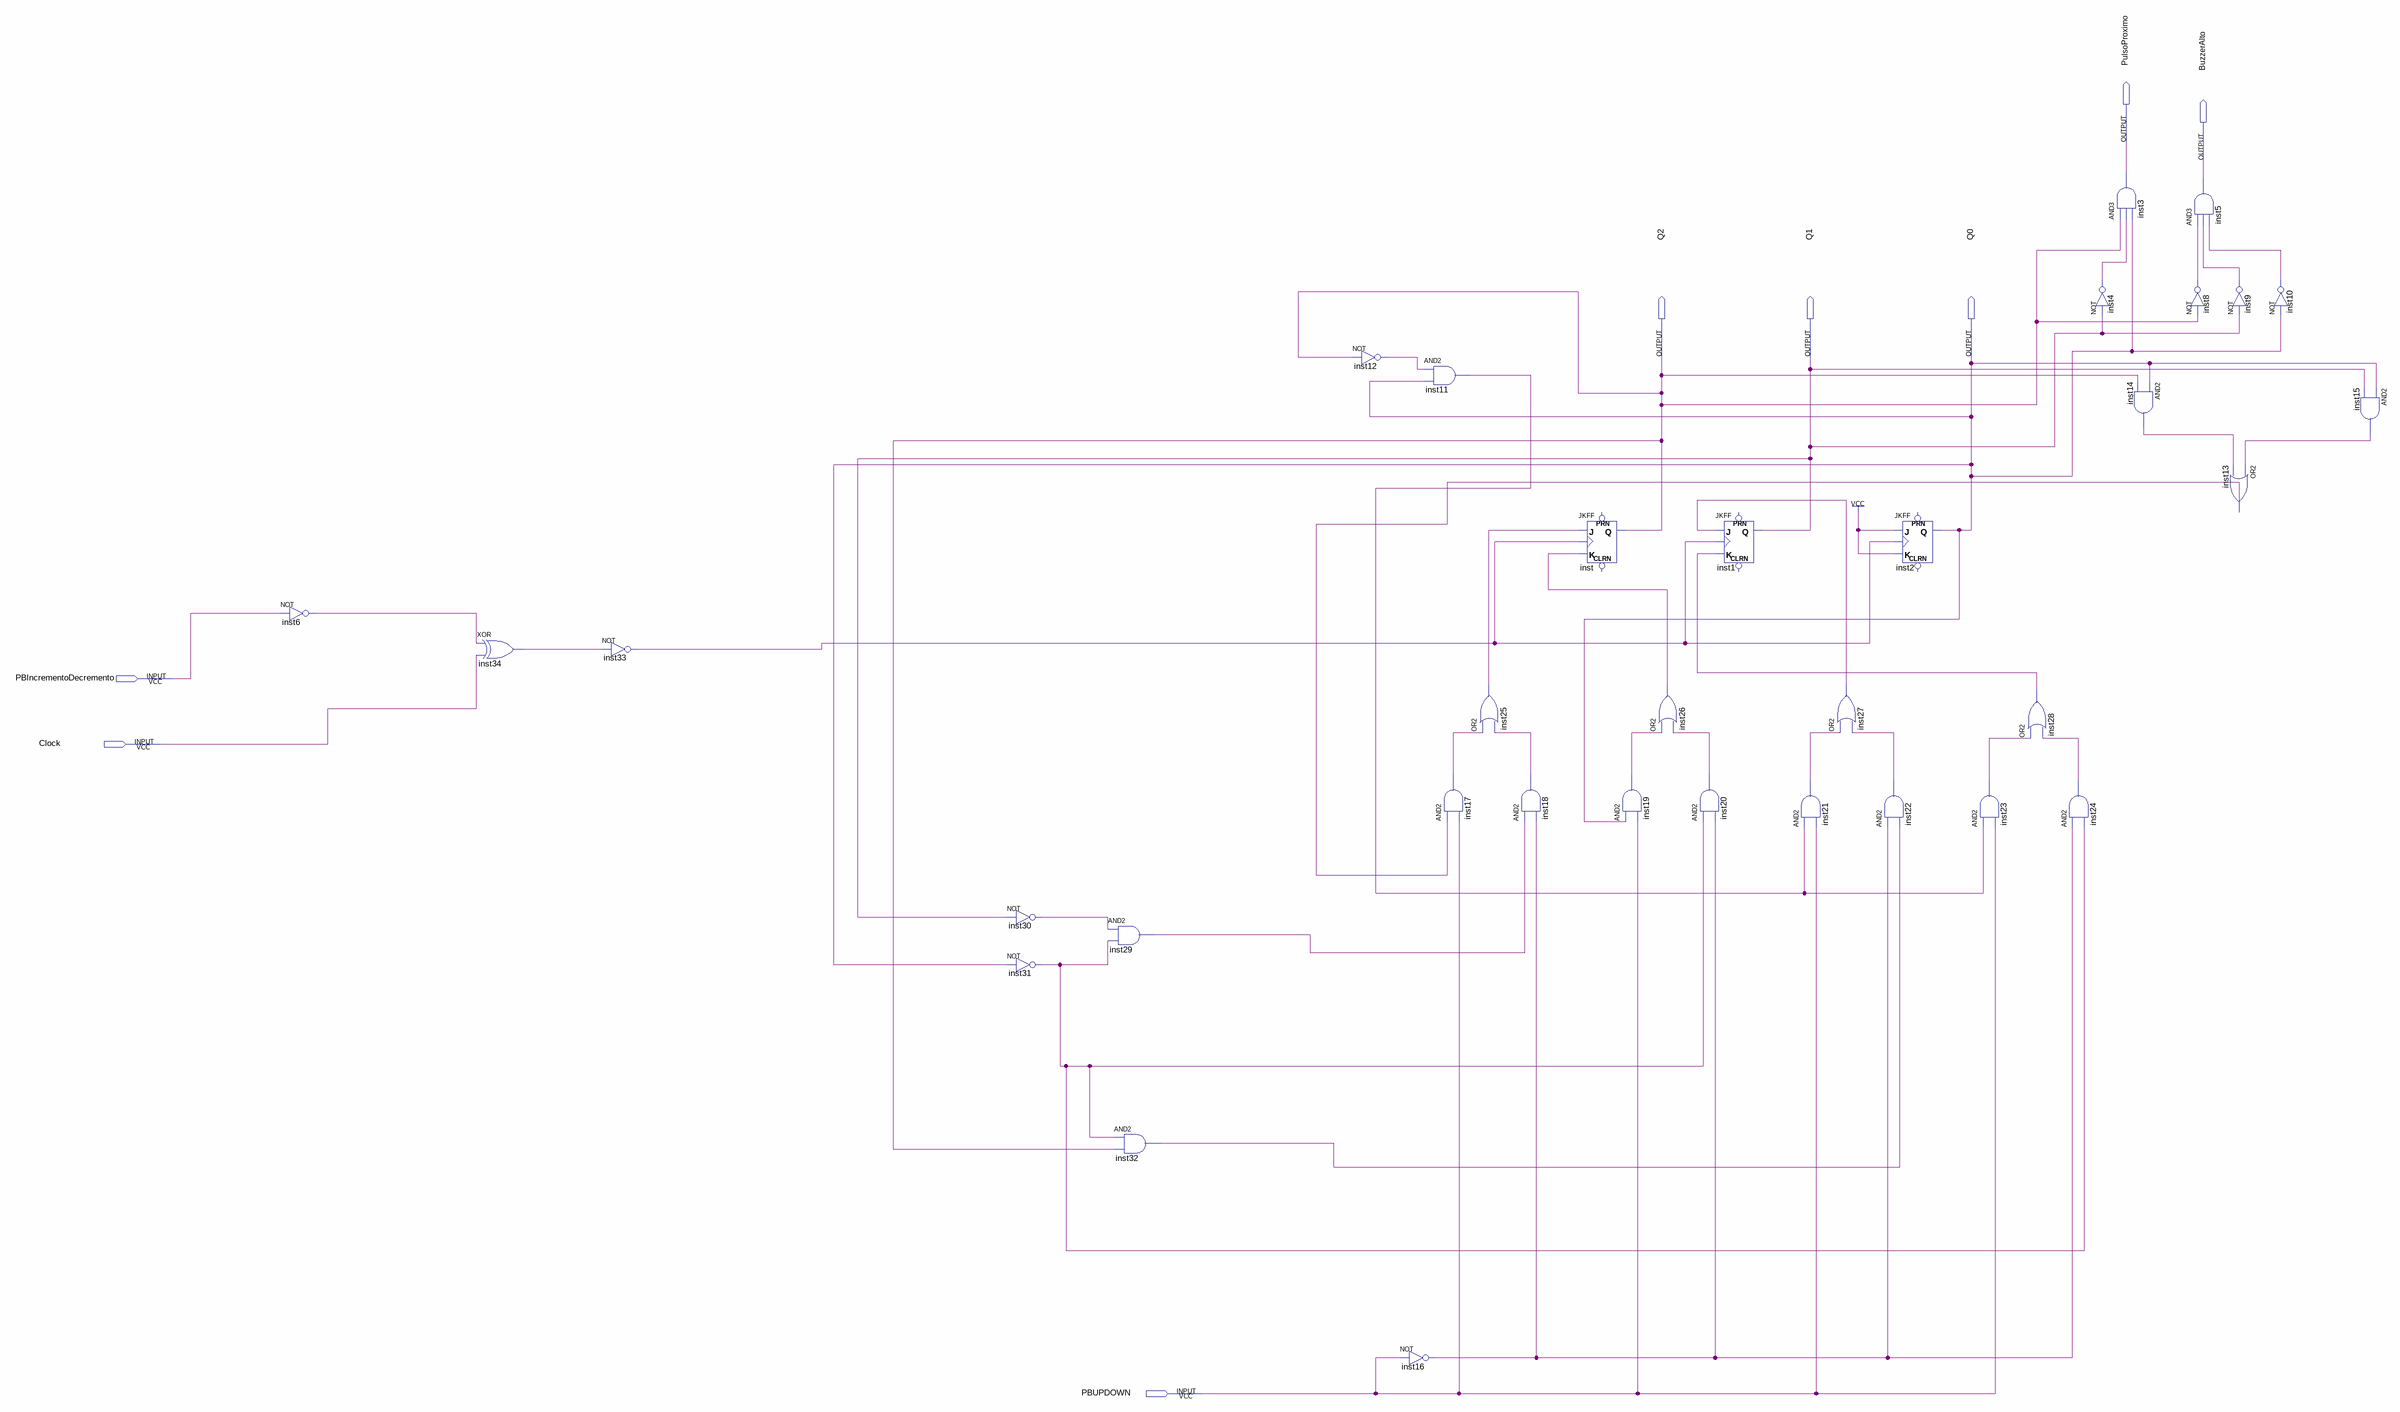
[diagram p0: schematic sheet]
// Quartus schematic contador0a5.bdf as structural Verilog: 34 symbols, 8 pins
module contador0a5 (
  input  PBIncrementoDecremento,
  input  Clock,
  input  PBUPDOWN,
  output PulsoProximo,
  output BuzzerAlto,
  output Q2,
  output Q1,
  output Q0
);

  wire inst4_out, inst6_out, inst8_out, inst9_out, inst10_out, inst11_out, inst12_out, inst13_out,
       inst14_out, inst15_out, inst16_out, inst17_out, inst18_out, inst19_out, inst20_out, inst21_out,
       inst22_out, inst23_out, inst24_out, inst25_out, inst26_out, inst27_out, inst28_out, inst29_out,
       inst30_out, inst31_out, inst32_out, inst33_out, inst34_out;

  not inst6 (inst6_out, PBIncrementoDecremento);
  xor inst34 (inst34_out, inst6_out, Clock);
  not inst33 (inst33_out, inst34_out);
  not inst30 (inst30_out, Q1);
  not inst31 (inst31_out, Q0);
  and inst29 (inst29_out, inst30_out, inst31_out);
  and inst32 (inst32_out, inst31_out, Q2);
  not inst12 (inst12_out, Q2);
  not inst16 (inst16_out, PBUPDOWN);
  and inst11 (inst11_out, inst12_out, Q0);
  and inst17 (inst17_out, inst13_out, PBUPDOWN);
  or inst25 (inst25_out, inst17_out, inst18_out);
  and inst18 (inst18_out, inst29_out, inst16_out);
  JKFF inst (.K(inst26_out), .J(inst25_out), .CLK(inst33_out), .Q(Q2));  // open: PRN, CLRN
  or inst26 (inst26_out, inst19_out, inst20_out);
  and inst19 (inst19_out, Q0, PBUPDOWN);
  and inst20 (inst20_out, inst31_out, inst16_out);
  JKFF inst1 (.K(inst28_out), .J(inst27_out), .CLK(inst33_out), .Q(Q1));  // open: PRN, CLRN
  and inst21 (inst21_out, inst11_out, PBUPDOWN);
  or inst27 (inst27_out, inst21_out, inst22_out);
  and inst22 (inst22_out, inst16_out, inst32_out);
  JKFF inst2 (.K(1'b1), .J(1'b1), .CLK(inst33_out), .Q(Q0));  // open: PRN, CLRN
  and inst23 (inst23_out, inst11_out, PBUPDOWN);
  or inst28 (inst28_out, inst23_out, inst24_out);
  and inst24 (inst24_out, inst16_out, inst31_out);
  and inst3 (PulsoProximo, Q2, inst4_out, Q0);
  not inst4 (inst4_out, Q1);
  and inst14 (inst14_out, Q0, Q2);
  and inst5 (BuzzerAlto, inst8_out, inst9_out, inst10_out);
  not inst8 (inst8_out, Q2);
  or inst13 (inst13_out, inst15_out, inst14_out);
  not inst9 (inst9_out, Q1);
  not inst10 (inst10_out, Q0);
  and inst15 (inst15_out, Q0, Q1);
endmodule
